# EasyEDA schematic 1-Schematic_Race_project_receiver.json
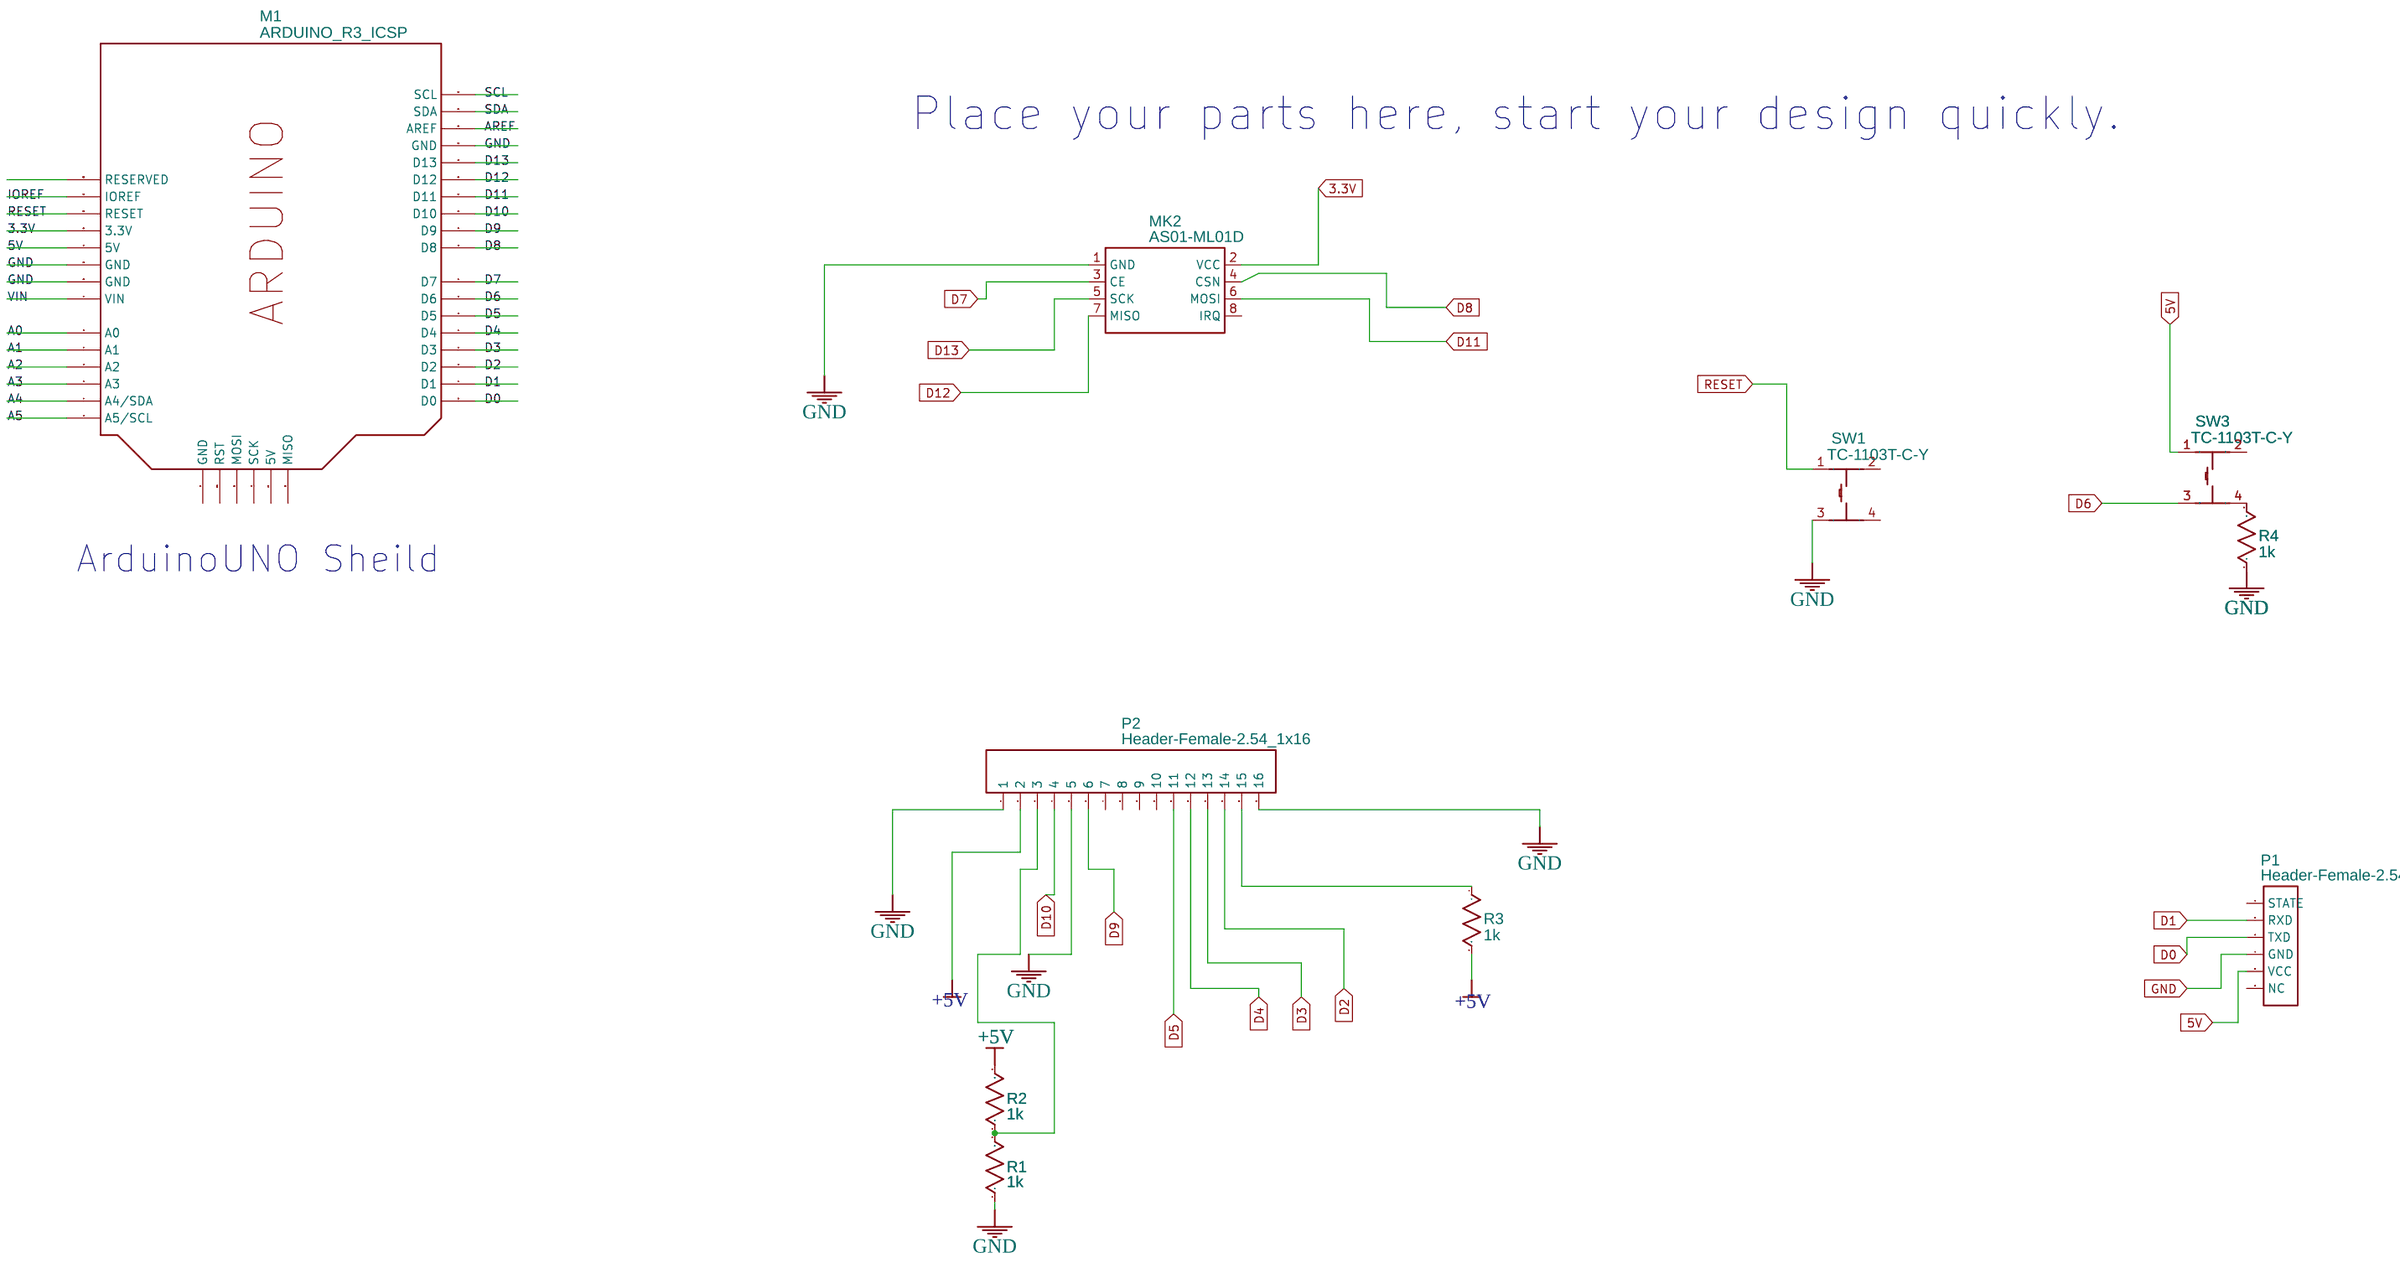
[diagram p0: schematic sheet]

## Parts
M1  ARDUINO_R3_ICSP  [ARDUINOR3_ICSP]
MK2  AS01-ML01D  [NRF24L01+]
P1  Header-Female-2.54_1x6  [HDR-6X1/2.54]
P2  Header-Female-2.54_1x16  [HDR-16X1/2.54]
R1  1k  [AXIAL-0.3]
R2  1k  [AXIAL-0.3]
R3  1k  [AXIAL-0.3]
R4  1k  [AXIAL-0.3]
SW1  TC-1103T-C-Y  [SW-DIP-12X12X17]
SW3  TC-1103T-C-Y  [SW-DIP-12X12X17]

## Library data of the parts
M1 = -: catid: 20; sourceId: qGgecxTfB; Manufacturer Part: ?
MK2 = -: Supplier: LCSC; Manufacturer: Ashining; Supplier Part: C84803
P1 = -: Supplier: LCSC; Manufacturer: BOOMELE; Manufacturer Part: Female header 1*6p; Supplier Part: C40877
P2 = -: Supplier: LCSC; Manufacturer: BOOMELE; Manufacturer Part: Female header1*16P pitch 2.54mm; image: //image.lceda.cn/szlcsc/C66987.jpg; Supplier Part: C66987
R1-R4 = Res_AXIAL-0.3(1/8W)_US: Manufacturer Part: ?
SW1 SW3 = -: Supplier: LCSC; Supplier Part: C318966; Manufacturer: XKB Enterprise; Contributor: LCSC

## Nets
3.3V: M1.3.3V MK2.2(VCC)
5V: M1.5V P1.5(VCC) SW3.1
+5V: P2.2 R2.2 R3.2
GND: M1.GND MK2.1(GND) P1.4(GND) P2.1 P2.5 P2.16 R1.1 R4.1 SW1.3
VIN: M1.VIN
A0: M1.A0
A1: M1.A1
A2: M1.A2
A3: M1.A3
A4: M1.A4(A4/SDA)
A5: M1.A5(A5/SCL)
AREF: M1.AREF
D0: M1.D0 P1.3(TXD)
D1: M1.D1 P1.2(RXD)
D2: M1.D2 P2.14
D3: M1.D3 P2.13
D4: M1.D4 P2.12
D5: M1.D5 P2.11
D6: M1.D6 SW3.3
D7: M1.D7 MK2.3(CE)
D8: M1.D8 MK2.4(CSN)
D9: M1.D9 P2.6
D10: M1.D10 P2.4
D11: M1.D11 MK2.6(MOSI)
D12: M1.D12 MK2.7(MISO)
D13: M1.D13 MK2.5(SCK)
IOREF: M1.IOREF
RESET: M1.RESET SW1.1
SCL: M1.SCL
SDA: M1.SDA
Net-(P2-3): P2.3 R1.2 R2.1
Net-(P2-15): P2.15 R3.1
Net-(R4-2): R4.2 SW3.4

Not connected (* = marked no-connect by the designer): M1 5V_ICSP(5V) MISO MOSI RESERVED RESET_ICSP(RST) SCK; MK2 8(IRQ); P1 1(STATE) 6(NC); P2 7 8 9 10; SW1 2 4; SW3 2

## Notes on the sheet
- Place your parts here, start your design quickly.
- ArduinoUNO Sheild
